# Altium schematic sheet 11_Power.SchDoc: Power (part 1 of 3)
size A3; Organization: Lime Microsystems; Address1: Surrey Tech Centre; Address2: Guildford GU2 7YG; Address3: Surrey; Address4: United Kingdom; Revision: v1.0; SheetNumber: 11; SheetTotal: 11
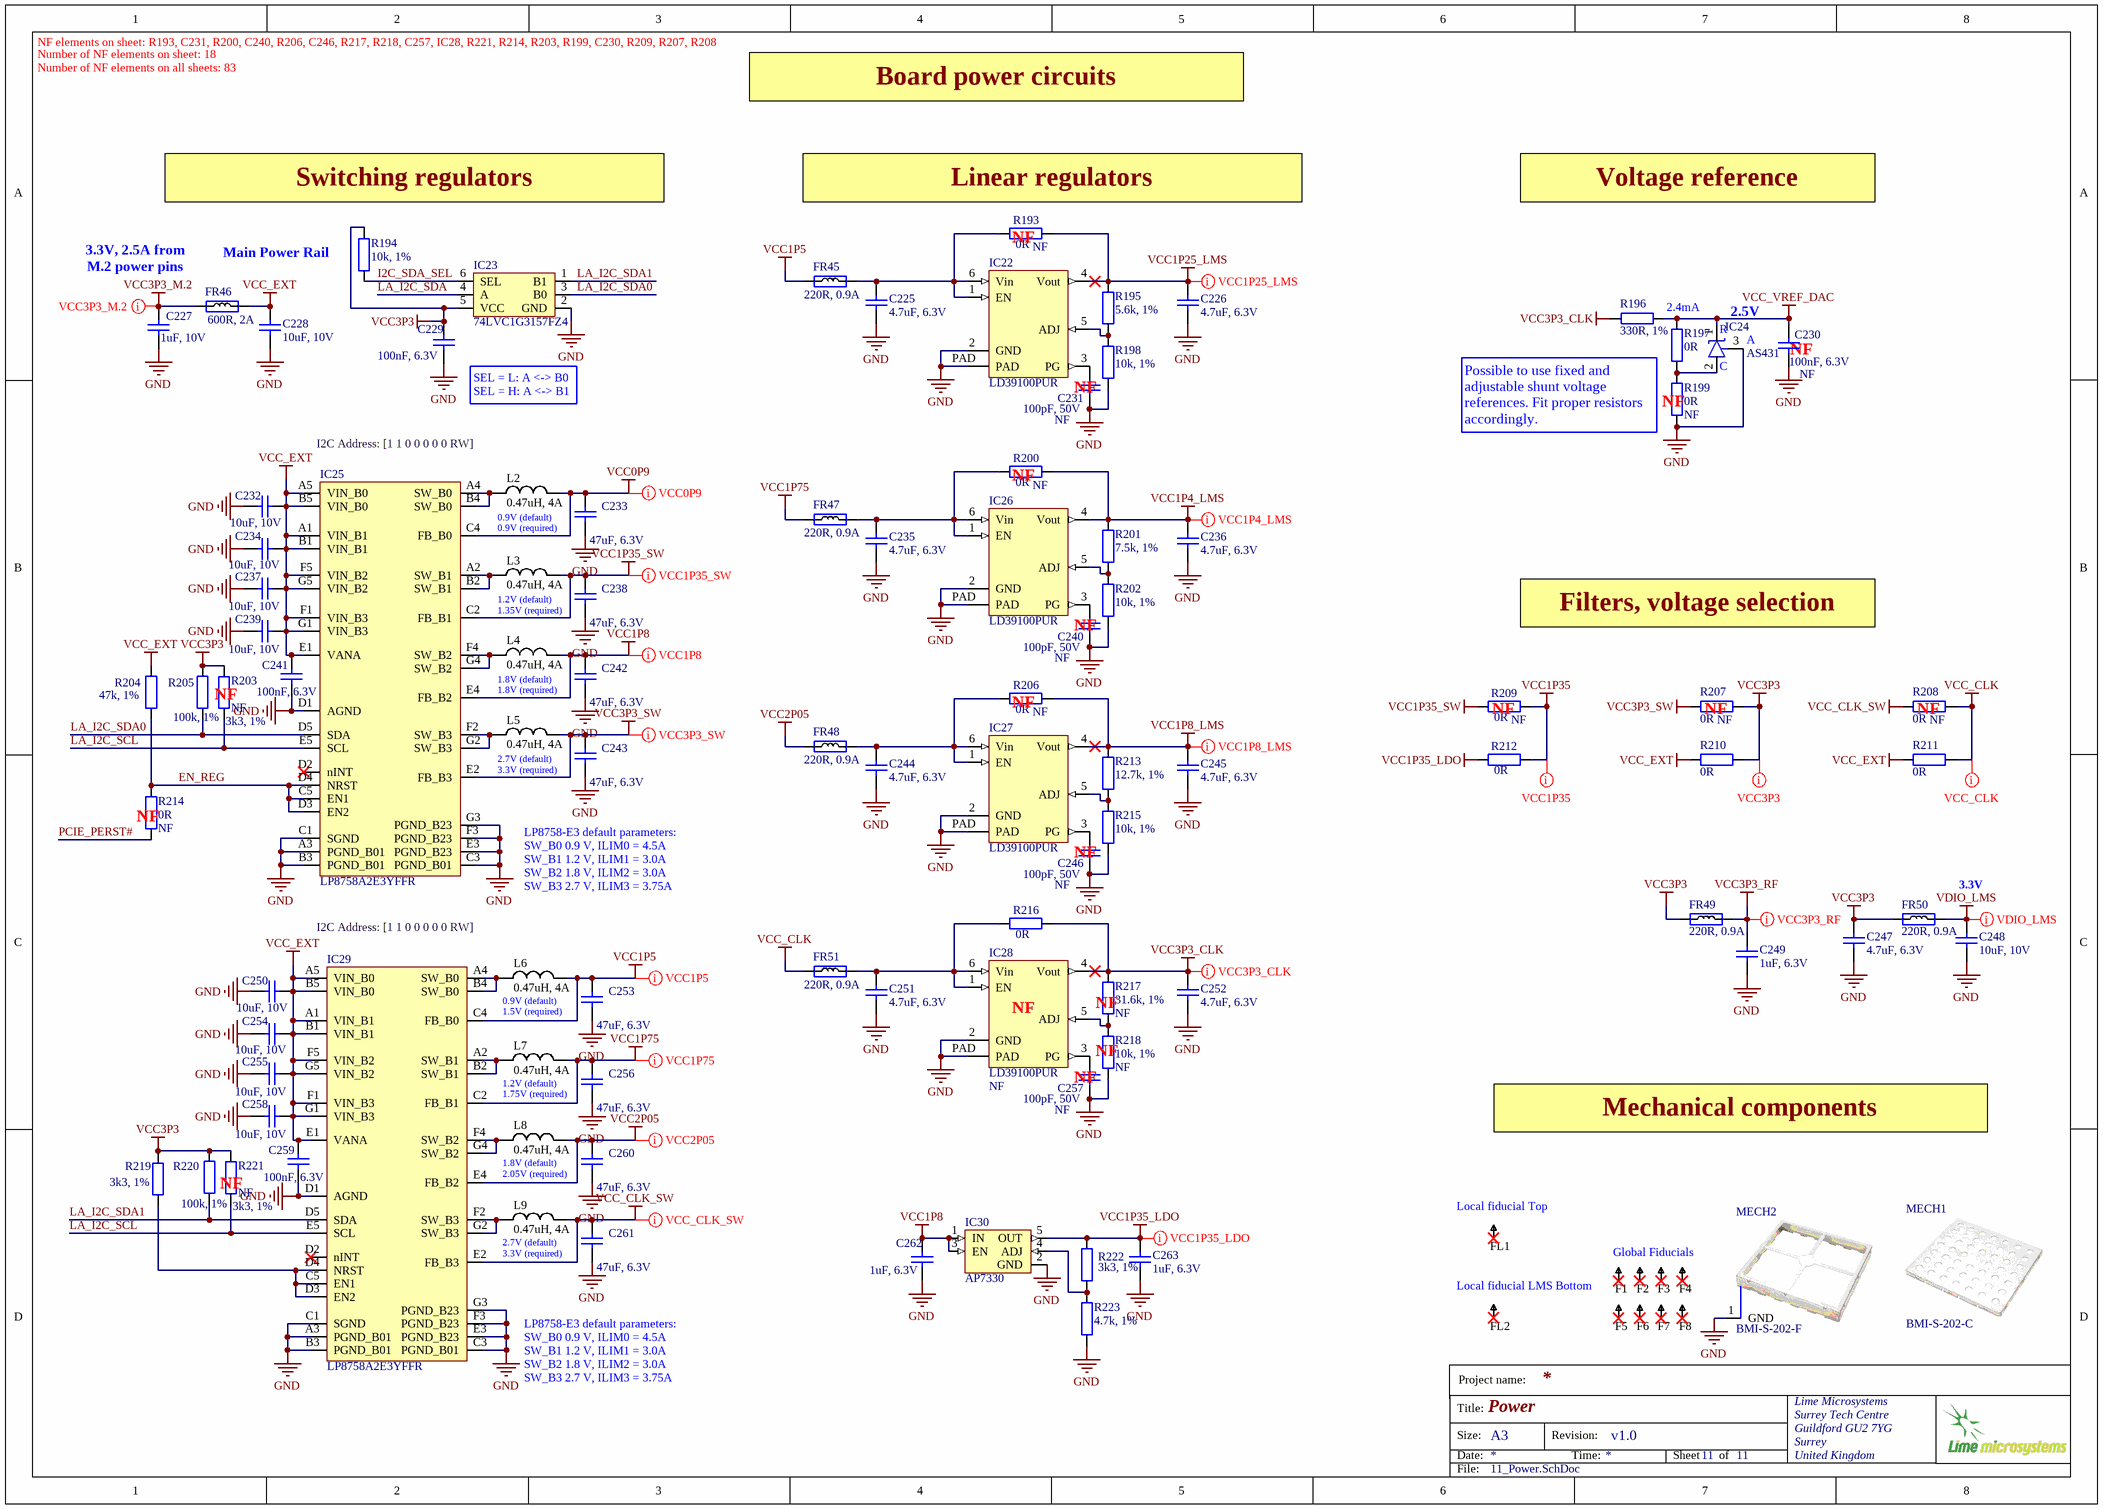
[diagram p0: 11_Power.SchDoc]

## Parts
C225  4.7uF, 6.3V  [CAP0402]
C226  4.7uF, 6.3V  [CAP0402]
C227  1uF, 10V  [CAP0402]
C228  10uF, 10V  [CAP0603]
C229  100nF, 6.3V  [CAP0201]
C230  100nF, 6.3V  Assembly Info: NF  [CAP0201]
C231  100pF, 50V  Assembly Info: NF  [CAP0201]
C232  10uF, 10V  [CAP0603]
C233  47uF, 6.3V  [CAP0603]
C234  10uF, 10V  [CAP0603]
C235  4.7uF, 6.3V  [CAP0402]
C236  4.7uF, 6.3V  [CAP0402]
C237  10uF, 10V  [CAP0603]
C238  47uF, 6.3V  [CAP0603]
C239  10uF, 10V  [CAP0603]
C240  100pF, 50V  Assembly Info: NF  [CAP0201]
C241  100nF, 6.3V  [CAP0201]
C242  47uF, 6.3V  [CAP0603]
C243  47uF, 6.3V  [CAP0603]
C244  4.7uF, 6.3V  [CAP0402]
C245  4.7uF, 6.3V  [CAP0402]
C246  100pF, 50V  Assembly Info: NF  [CAP0201]
C247  4.7uF, 6.3V  [CAP0402]
C248  10uF, 10V  [CAP0603]
C249  1uF, 6.3V  [CAP0201]
C250  10uF, 10V  [CAP0603]
C251  4.7uF, 6.3V  [CAP0402]
C252  4.7uF, 6.3V  [CAP0402]
C253  47uF, 6.3V  [CAP0603]
C254  10uF, 10V  [CAP0603]
C255  10uF, 10V  [CAP0603]
C256  47uF, 6.3V  [CAP0603]
C257  100pF, 50V  Assembly Info: NF  [CAP0201]
C258  10uF, 10V  [CAP0603]
C259  100nF, 6.3V  [CAP0201]
C260  47uF, 6.3V  [CAP0603]
C261  47uF, 6.3V  [CAP0603]
C262  1uF, 6.3V  [CAP0201]
C263  1uF, 6.3V  [CAP0201]
F1  Fiducial  [Fiducial]  (value not drawn)
F2  Fiducial  [Fiducial]  (value not drawn)
F3  Fiducial  [Fiducial]  (value not drawn)
F4  Fiducial  [Fiducial]  (value not drawn)
F5  Fiducial  [Fiducial]  (value not drawn)
F6  Fiducial  [Fiducial]  (value not drawn)
F7  Fiducial  [Fiducial]  (value not drawn)
F8  Fiducial  [Fiducial]  (value not drawn)
FL1  Fiducial  [Fiducial_local]  (value not drawn)
FL2  Fiducial  [Fiducial_local]  (value not drawn)
FR45  220R, 0.9A  [RES0402]
FR46  600R, 2A  [RES0805]
FR47  220R, 0.9A  [RES0402]
FR48  220R, 0.9A  [RES0402]
FR49  220R, 0.9A  [RES0402]
FR50  220R, 0.9A  [RES0402]
FR51  220R, 0.9A  [RES0402]
IC22  LD39100PUR  [LD39100PUR]
IC23  74LVC1G3157FZ4  [74LVC1G3157FZ4_SPDT_SW_DFN1410-6]
IC24  AS431  [SOT23-3_v3]
IC25  LP8758A2E3YFFR  [LP8758A1E0YFFR_QUAD_DC-DC_35DSBGA]
IC26  LD39100PUR  [LD39100PUR]
IC27  LD39100PUR  [LD39100PUR]
IC28  LD39100PUR  Assembly Info: NF  [LD39100PUR]
IC29  LP8758A2E3YFFR  [LP8758A1E0YFFR_QUAD_DC-DC_35DSBGA]
IC30  AP7330  [AP7330-W5-7_SOT25]
L2  0.47uH, 4A  [IND0806]
L3  0.47uH, 4A  [IND0806]
L4  0.47uH, 4A  [IND0806]
L5  0.47uH, 4A  [IND0806]
L6  0.47uH, 4A  [IND0806]
L7  0.47uH, 4A  [IND0806]
L8  0.47uH, 4A  [IND0806]
L9  0.47uH, 4A  [IND0806]
MECH1  BMI-S-202-C  [BMI-S-202-C_RF_SHIELD_COVER]
MECH2  BMI-S-202-F  [BMI-S-202-F_RF_SHIELD_FRAME_v3]
R193  0R  Assembly Info: NF  [RES0201]
R194  10k, 1%  [RES0201]
R195  5.6k, 1%  [RES0201]
R196  330R, 1%  [RES0201]
R197  0R  [RES0201]
R198  10k, 1%  [RES0201]
R199  0R  Assembly Info: NF  [RES0201]
R200  0R  Assembly Info: NF  [RES0201]
R201  7.5k, 1%  [RES0201]
R202  10k, 1%  [RES0201]
R203  3k3, 1%  Assembly Info: NF  [RES0201]
R204  47k, 1%  [RES0201]
R205  100k, 1%  [RES0201]
R206  0R  Assembly Info: NF  [RES0201]
R207  0R  Assembly Info: NF  [RES0402]
R208  0R  Assembly Info: NF  [RES0402]
R209  0R  Assembly Info: NF  [RES0201]
R210  0R  [RES0402]
R211  0R  [RES0402]
R212  0R  [RES0201]
R213  12.7k, 1%  [RES0201]
R214  0R  Assembly Info: NF  [RES0201]
R215  10k, 1%  [RES0201]
R216  0R  [RES0201]
R217  31.6k, 1%  Assembly Info: NF  [RES0201]
R218  10k, 1%  Assembly Info: NF  [RES0201]
R219  3k3, 1%  [RES0201]
R220  100k, 1%  [RES0201]
R221  3k3, 1%  Assembly Info: NF  [RES0201]
R222  3k3, 1%  [RES0201]
R223  4.7k, 1%  [RES0201]

## Nets
GND: C225.1 C226.1 C227.1 C228.1 C229.2 C230.2 C231.1 C232.1 C233.1 C234.1 C235.1 C236.1 C237.1 C238.1 C239.1 C240.1 C241.2 C242.1 C243.1 C244.1 C245.1 C246.1 C247.1 C248.1 C249.2 C250.1 C251.1 C252.1 C253.1 C254.1 C255.1 C256.1 C257.1 C258.1 C259.2 C260.1 C261.1 C262.2 C263.2 IC22.2(GND) IC22.PAD IC23.2(GND) IC24.3(NC/A) IC25.A3(PGND_B01) IC25.B3(PGND_B01) IC25.C1(SGND) IC25.C3(PGND_B01) IC25.D1(AGND) IC25.E3(PGND_B23) IC25.F3(PGND_B23) IC25.G3(PGND_B23) IC26.2(GND) IC26.PAD IC27.2(GND) IC27.PAD IC28.2(GND) IC28.PAD IC29.A3(PGND_B01) IC29.B3(PGND_B01) IC29.C1(SGND) IC29.C3(PGND_B01) IC29.D1(AGND) IC29.E3(PGND_B23) IC29.F3(PGND_B23) IC29.G3(PGND_B23) IC30.2(GND) MECH2.1(GND) R198.2 R199.2 R202.2 R215.2 R218.2 R223.2
VCC0P9: C233.2 IC25.C4(FB_B0) L2.2
VCC1P4_LMS: C236.2 IC26.4(Vout) R200.2 R201.1
VCC1P5: C253.2 FR45.1 IC29.C4(FB_B0) L6.2
VCC1P8: C242.2 C262.1 IC25.E4(FB_B2) IC30.1(IN) IC30.3(EN) L4.2
VCC1P8_LMS: C245.2 IC27.4(Vout) R206.2 R213.1
VCC1P25_LMS: C226.2 IC22.4(Vout) R193.2 R195.1
VCC1P35: R209.2 R212.2
VCC1P35_LDO: C263.1 IC30.5(OUT) R212.1 R222.1
VCC1P35_SW: C238.2 IC25.C2(FB_B1) L3.2 R209.1
VCC1P75: C256.2 FR47.1 IC29.C2(FB_B1) L7.2
VCC2P05: C260.2 FR48.1 IC29.E4(FB_B2) L8.2
VCC3P3: C229.1 C247.2 FR49.1 FR50.1 IC23.5(VCC) R194.2 R203.1 R205.1 R207.2 R210.2 R219.1 R220.1 R221.1
VCC3P3_CLK: C252.2 IC28.4(Vout) R196.2 R216.2 R217.1
VCC3P3_M.2: C227.2 FR46.1
VCC3P3_RF: C249.1 FR49.2
VCC3P3_SW: C243.2 IC25.E2(FB_B3) L5.2 R207.1
VCC_CLK: FR51.1 R208.2 R211.2
VCC_CLK_SW: C261.2 IC29.E2(FB_B3) L9.2 R208.1
VCC_EXT: C228.2 C232.2 C234.2 C237.2 C239.2 C241.1 C250.2 C254.2 C255.2 C258.2 C259.1 FR46.2 IC25.A1(VIN_B1) IC25.A5(VIN_B0) IC25.B1(VIN_B1) IC25.B5(VIN_B0) IC25.E1(VANA) IC25.F1(VIN_B3) IC25.F5(VIN_B2) IC25.G1(VIN_B3) IC25.G5(VIN_B2) IC29.A1(VIN_B1) IC29.A5(VIN_B0) IC29.B1(VIN_B1) IC29.B5(VIN_B0) IC29.E1(VANA) IC29.F1(VIN_B3) IC29.F5(VIN_B2) IC29.G1(VIN_B3) IC29.G5(VIN_B2) R204.1 R210.1 R211.1
VCC_VREF_DAC: C230.1 IC24.1(K) R196.1 R197.1
VDIO_LMS: C248.2 FR50.2
EN_REG: IC25.C5(EN1) IC25.D3(EN2) IC25.D4(NRST) R204.2 R214.2
I2C_SDA_SEL: IC23.6(SEL) R194.1
LA_I2C_SCL: IC25.E5(SCL) IC29.E5(SCL) R203.2 R221.2
LA_I2C_SDA: IC23.4(A)
LA_I2C_SDA0: IC23.3(B0) IC25.D5(SDA) R205.2
LA_I2C_SDA1: IC23.1(B1) IC29.D5(SDA) R220.2
PCIE_PERST#: R214.1
NetC225_2: C225.2 FR45.2 IC22.1(EN) IC22.6(Vin) R193.1
NetC231_2: C231.2 IC22.3(PG)
NetC235_2: C235.2 FR47.2 IC26.1(EN) IC26.6(Vin) R200.1
NetC240_2: C240.2 IC26.3(PG)
NetC244_2: C244.2 FR48.2 IC27.1(EN) IC27.6(Vin) R206.1
NetC246_2: C246.2 IC27.3(PG)
NetC251_2: C251.2 FR51.2 IC28.1(EN) IC28.6(Vin) R216.1
NetC257_2: C257.2 IC28.3(PG)
NetIC22_5: IC22.5(ADJ) R195.2 R198.1
NetIC24_2: IC24.2(A) R197.2 R199.1
NetIC25_A2: IC25.A2(SW_B1) IC25.B2(SW_B1) L3.1
NetIC25_A4: IC25.A4(SW_B0) IC25.B4(SW_B0) L2.1
NetIC25_F2: IC25.F2(SW_B3) IC25.G2(SW_B3) L5.1
NetIC25_F4: IC25.F4(SW_B2) IC25.G4(SW_B2) L4.1
NetIC26_5: IC26.5(ADJ) R201.2 R202.1
NetIC27_5: IC27.5(ADJ) R213.2 R215.1
NetIC28_5: IC28.5(ADJ) R217.2 R218.1
NetIC29_A2: IC29.A2(SW_B1) IC29.B2(SW_B1) L7.1
NetIC29_A4: IC29.A4(SW_B0) IC29.B4(SW_B0) L6.1
NetIC29_C5: IC29.C5(EN1) IC29.D3(EN2) IC29.D4(NRST) R219.2
NetIC29_F2: IC29.F2(SW_B3) IC29.G2(SW_B3) L9.1
NetIC29_F4: IC29.F4(SW_B2) IC29.G4(SW_B2) L8.1
NetIC30_4: IC30.4(ADJ) R222.2 R223.1

Not connected (* = marked no-connect by the designer): F1 1*; F2 1*; F3 1*; F4 1*; F5 1*; F6 1*; F7 1*; F8 1*; FL1 1*; FL2 1*; IC25 D2(nINT)*; IC29 D2(nINT)*

## Layout directives
net class VCC1P25_LMS: VCC1P25_LMS
net class VCC1P4_LMS: VCC1P4_LMS
net class VCC1P8_LMS: VCC1P8_LMS
net class VCC3P3_CLK: VCC3P3_CLK
net class VCC1P5: VCC1P5
net class VCC0P9: VCC0P9
net class VCC1P35_SW: VCC1P35_SW
net class VCC1P8: VCC1P8
net class VCC3P3_SW: VCC3P3_SW
net class VCC1P75: VCC1P75
net class VCC2P5: VCC2P05
net class VCC_CLK_SW: VCC_CLK_SW
net class VCC1P35_LDO: VCC1P35_LDO
net class VCC3P3_M.2: VCC3P3_M.2
net class VCC_CLK: VCC_CLK
net class VCC3P3: VCC3P3
net class VCC1P35: VCC1P35
net class VDIO_LMS: VDIO_LMS
net class VCC3P3_RF: VCC3P3_RF

## Notes on the sheet
- NF elements on sheet: R193, C231, R200, C240, R206, C246, R217, R218, C257, IC28, R221, R214, R203, R199, C230, R209, R207, R208
- Number of NF elements on sheet: 18
- Number of NF elements on all sheets: 83
- Board power circuits
- (near R194) Switching regulators
- (near R193) Linear regulators
- (near R193) NF
- Voltage reference
- 3.3V, 2.5A from M.2 power pins
- Main Power Rail
- 2.4mA
- 2.5V
- (near IC24) C
- (near IC24) R
- (near IC24) A
- (near C230) NF
- I2C Address: [1 1 0 0 0 0 0 RW]
- (near C229) SEL = L: A <-> B0
  SEL = H: A <-> B1
- NF
- Possible to use fixed and adjustable shunt voltage references. Fit proper resistors accordingly.
- (near R199) NF
- (near R200) NF
- 0.9V (default)
  0.9V (required)
- 1.2V (default)
  1.35V (required)
- Filters, voltage selection
- 1.8V (default)
  1.8V (required)
- (near R206) NF
- (near R209) NF
- (near R207) NF
- (near R208) NF
- 2.7V (default)
  3.3V (required)
- (near R214) NF
- LP8758-E3 default parameters:
  SW_B0 0.9 V, ILIM0 = 4.5A
  SW_B1 1.2 V, ILIM1 = 3.0A
  SW_B2 1.8 V, ILIM2 = 3.0A
  SW_B3 2.7 V, ILIM3 = 3.75A
- 3.3V
- 0.9V (default)
  1.5V (required)
- (near IC28) NF
- (near R218) NF
- (near R217) NF
- 1.2V (default)
  1.75V (required)
- Mechanical components
- 1.8V (default)
  2.05V (required)
- (near FL1) Local fiducial Top
- Global Fiducials
- Local fiducial LMS Bottom
- Project name:
- Title:
- Size:
- Date:
- A3
- Revision:
- Time:
- Sheet
- of
- File: